# Altium schematic sheet main.SchDoc
size A
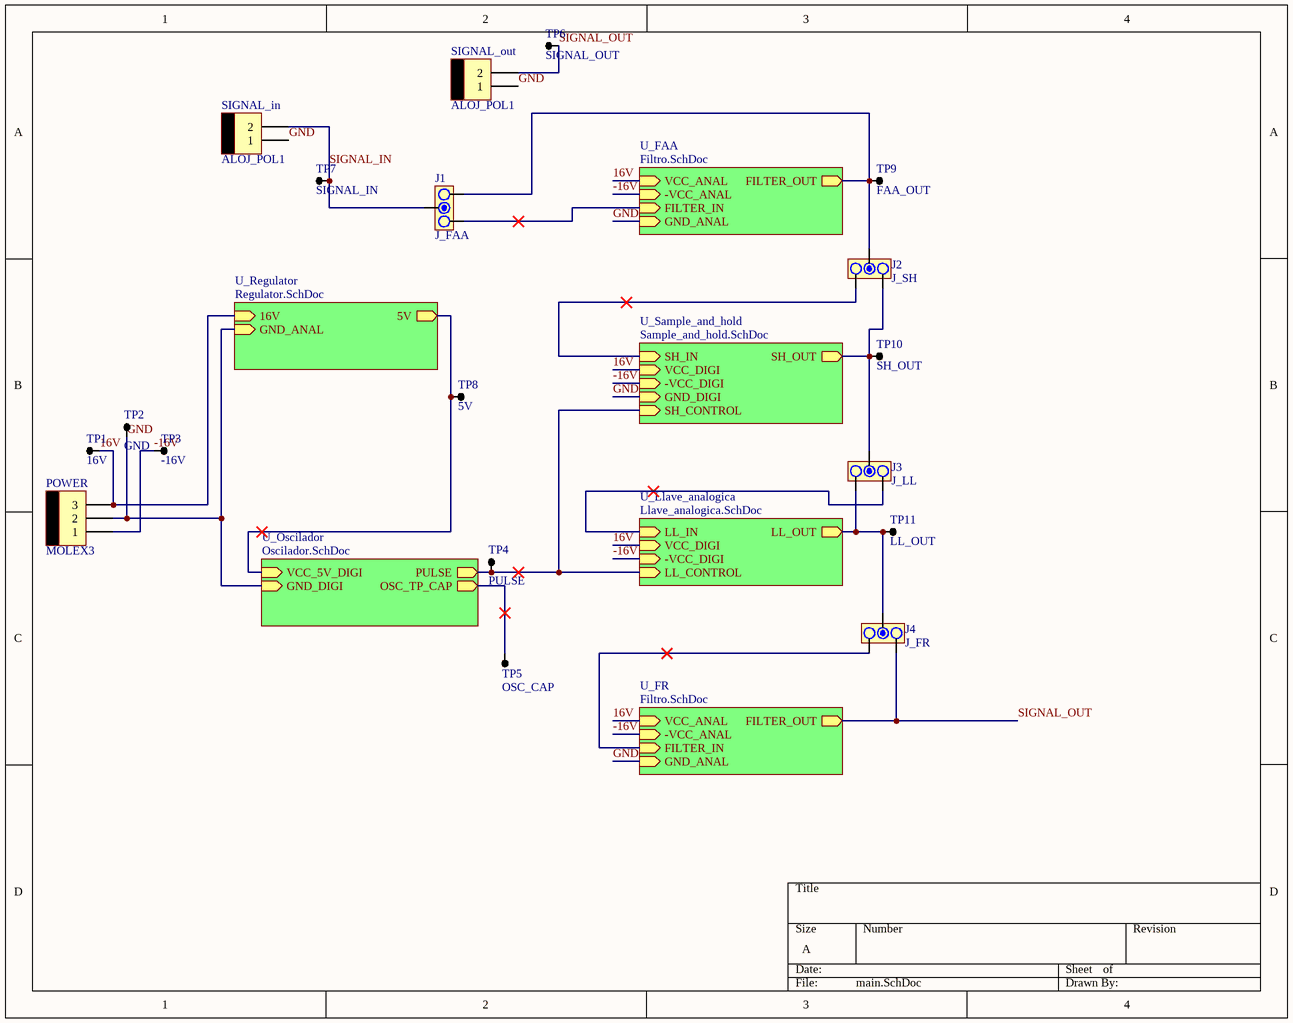
[diagram p0: main.SchDoc]

## Parts
J1  J_FAA  [JUMPER3]
J2  J_SH  [JUMPER3]
J3  J_LL  [JUMPER3]
J4  J_FR  [JUMPER3]
POWER  MOLEX3  [MOLEX3]
SIGNAL_in  ALOJ_POL1  [MOLEX2]
SIGNAL_out  ALOJ_POL1  [MOLEX2]
TP1  16V  [TPTH]
TP2  GND  [TPTH]
TP3  -16V  [TPTH]
TP4  PULSE  [TPTH]
TP5  OSC_CAP  [TPTH]
TP6  SIGNAL_OUT  [TPTH]
TP7  SIGNAL_IN  [TPTH]
TP8  5V  [TPTH]
TP9  FAA_OUT  [TPTH]
TP10  SH_OUT  [TPTH]
TP11  LL_OUT  [TPTH]

## Sub-sheets
U_FAA = Filtro.SchDoc: VCC_ANAL (in), -VCC_ANAL (in), FILTER_IN (in), FILTER_OUT (out), GND_ANAL (in)
U_FR = Filtro.SchDoc: VCC_ANAL (in), -VCC_ANAL (in), FILTER_IN (in), FILTER_OUT (out), GND_ANAL (in)
U_Llave_analogica = Llave_analogica.SchDoc: LL_IN (in), LL_OUT (out), VCC_DIGI (in), -VCC_DIGI (in), LL_CONTROL (in)
U_Oscilador = Oscilador.SchDoc: VCC_5V_DIGI (in), PULSE (out), GND_DIGI (in), OSC_TP_CAP (out)
U_Regulator = Regulator.SchDoc: 16V (in), 5V (out), GND_ANAL (in)
U_Sample_and_hold = Sample_and_hold.SchDoc: SH_IN (in), SH_OUT (out), VCC_DIGI (in), -VCC_DIGI (in), GND_DIGI (in), SH_CONTROL (in)

## Nets
16V: POWER.3 TP1.1 ; sheet U_FAA/VCC_ANAL, sheet U_FR/VCC_ANAL, sheet U_Llave_analogica/VCC_DIGI, sheet U_Sample_and_hold/VCC_DIGI, sheet U_Regulator/16V
-16V: POWER.1 TP3.1 ; sheet U_FAA/-VCC_ANAL, sheet U_FR/-VCC_ANAL, sheet U_Llave_analogica/-VCC_DIGI, sheet U_Sample_and_hold/-VCC_DIGI
GND: POWER.2 SIGNAL_in.1 SIGNAL_out.1 TP2.1 ; sheet U_Oscilador/GND_DIGI, sheet U_FAA/GND_ANAL, sheet U_FR/GND_ANAL, sheet U_Sample_and_hold/GND_DIGI, sheet U_Regulator/GND_ANAL
SIGNAL_IN: J1.2 SIGNAL_in.2 TP7.1
SIGNAL_OUT: J4.1 SIGNAL_out.2 TP6.1 ; sheet U_FR/FILTER_OUT
NetJ1_1: J1.1 J2.2 TP9.1 ; sheet U_FAA/FILTER_OUT
NetJ1_3: J1.3 ; sheet U_FAA/FILTER_IN
NetJ2_1: J2.1 J3.2 TP10.1 ; sheet U_Sample_and_hold/SH_OUT
NetJ2_3: J2.3 ; sheet U_Sample_and_hold/SH_IN
NetJ3_1: J3.1 ; sheet U_Llave_analogica/LL_IN
NetJ3_3: J3.3 J4.2 TP11.1 ; sheet U_Llave_analogica/LL_OUT
NetJ4_3: J4.3 ; sheet U_FR/FILTER_IN
NetTP4_1: TP4.1 ; sheet U_Oscilador/PULSE, sheet U_Llave_analogica/LL_CONTROL, sheet U_Sample_and_hold/SH_CONTROL
NetTP5_1: TP5.1 ; sheet U_Oscilador/OSC_TP_CAP
NetTP8_1: TP8.1 ; sheet U_Oscilador/VCC_5V_DIGI, sheet U_Regulator/5V

## Library data of the parts
J1-J4 = JUMPER3
SIGNAL_in SIGNAL_out = MOLEX2
TP1-TP11 = TP